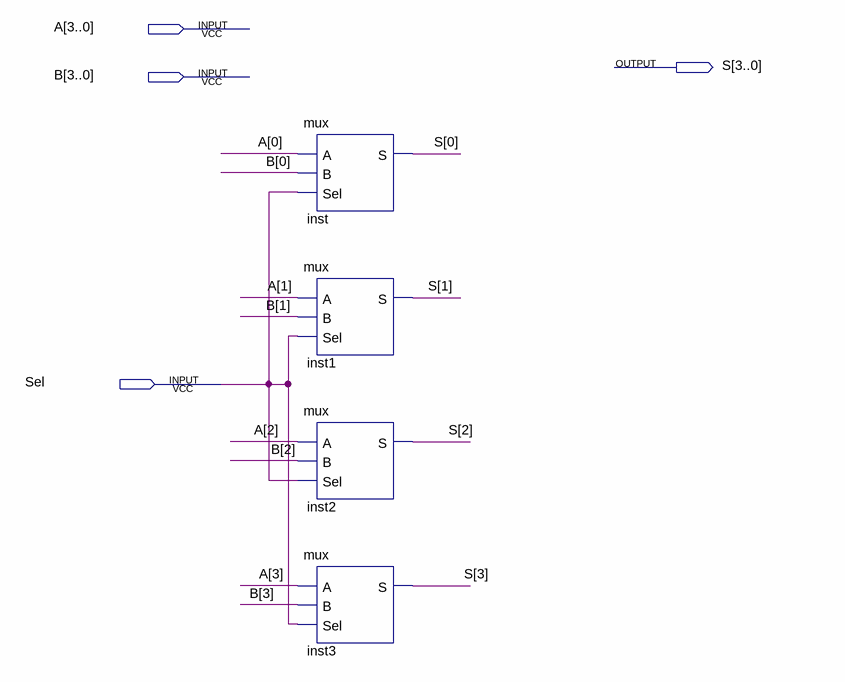
[diagram p0: schematic sheet]
// Quartus schematic mux4b.bdf as structural Verilog: 4 symbols, 4 pins
module mux4b (
  input  [3:0] A,
  input  [3:0] B,
  input  Sel,
  output [3:0] S
);

  mux inst (.A(A[0]), .B(B[0]), .Sel(Sel), .S(S[0]));
  mux inst1 (.A(A[1]), .B(B[1]), .Sel(Sel), .S(S[1]));
  mux inst2 (.A(A[2]), .B(B[2]), .Sel(Sel), .S(S[2]));
  mux inst3 (.A(A[3]), .B(B[3]), .Sel(Sel), .S(S[3]));
endmodule
